# EAGLE board Hive 1.0 (EAGLE 9.6.2), part 1 of 2
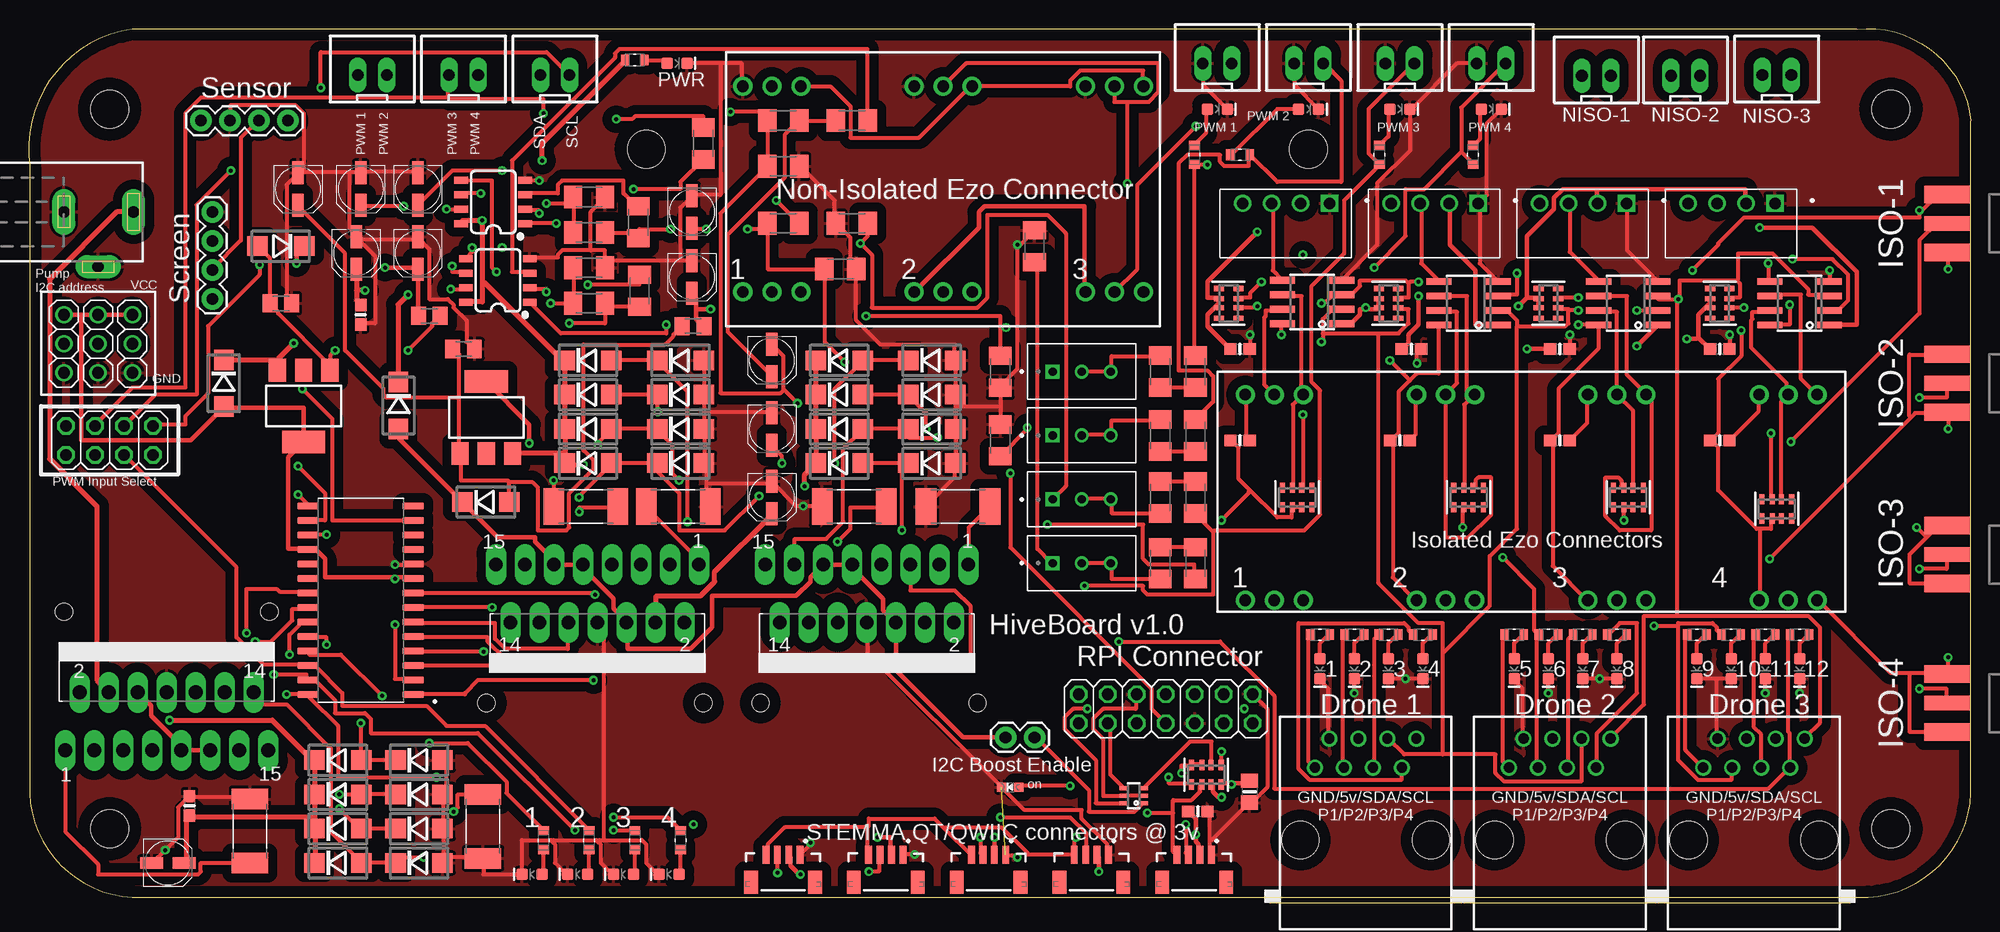
[diagram p2: board, top side]
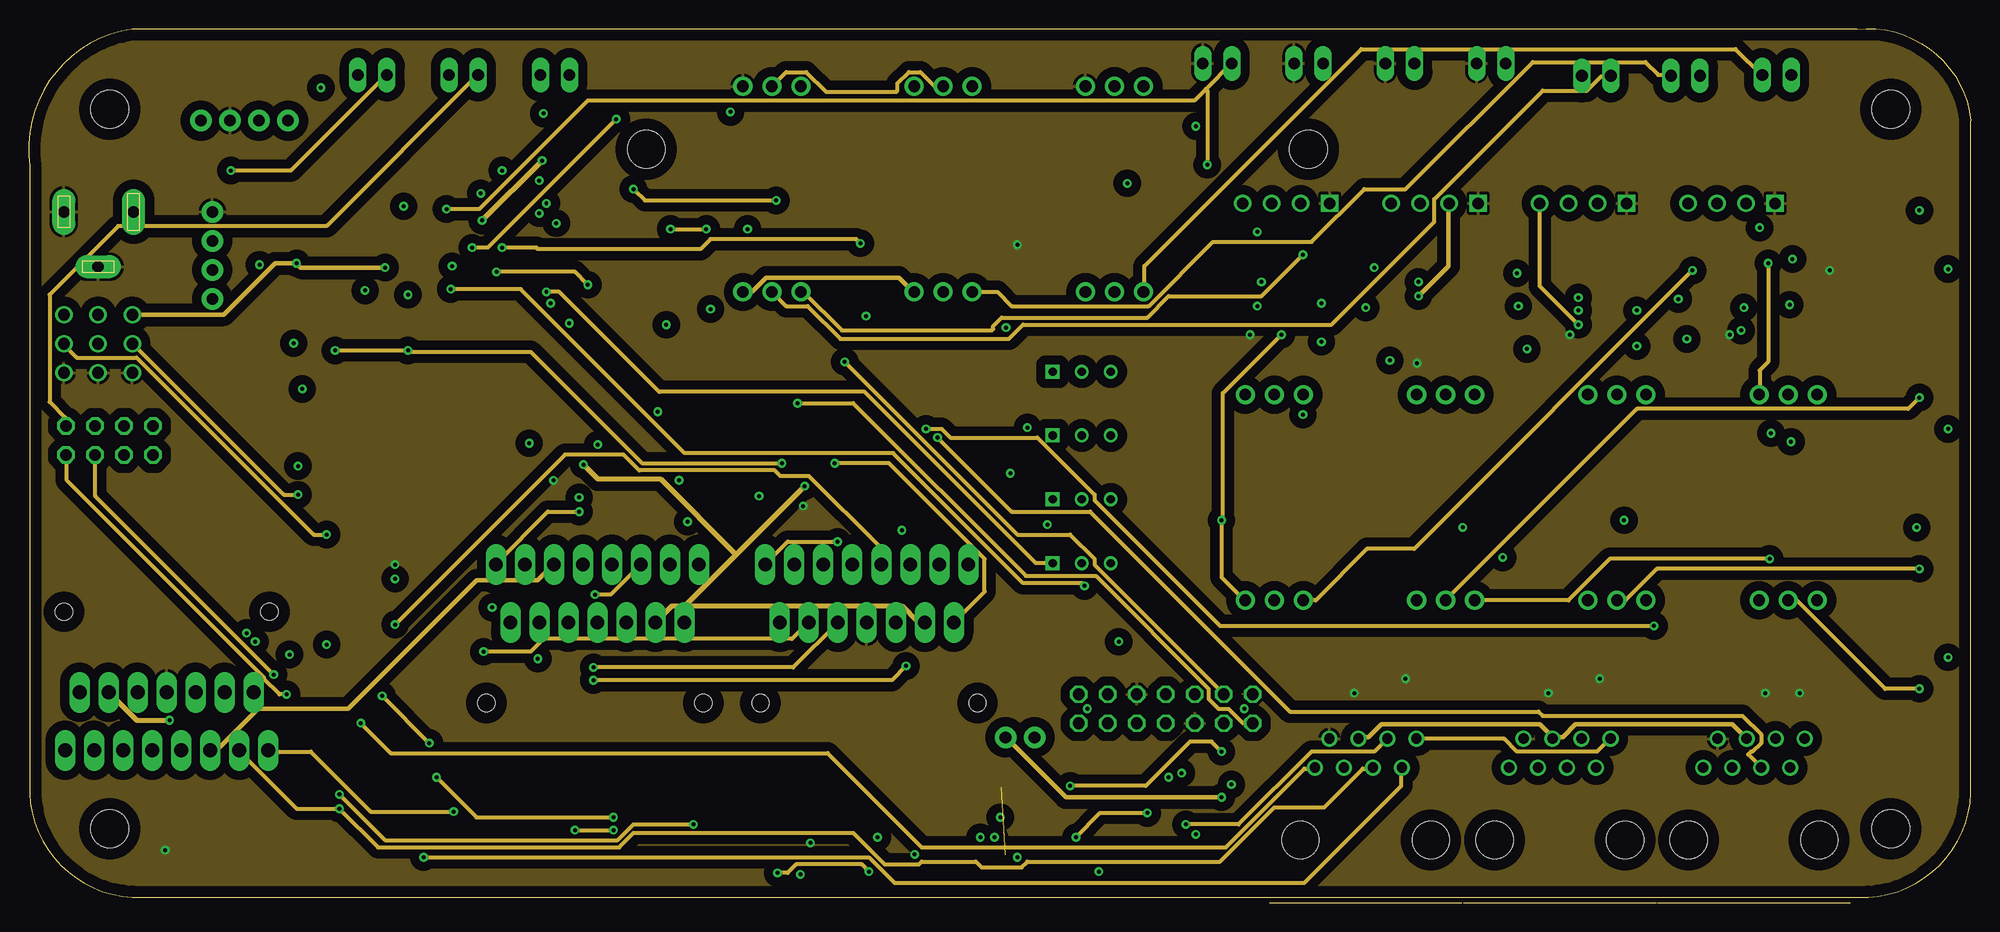
[diagram p3: board, inner layer Route2]
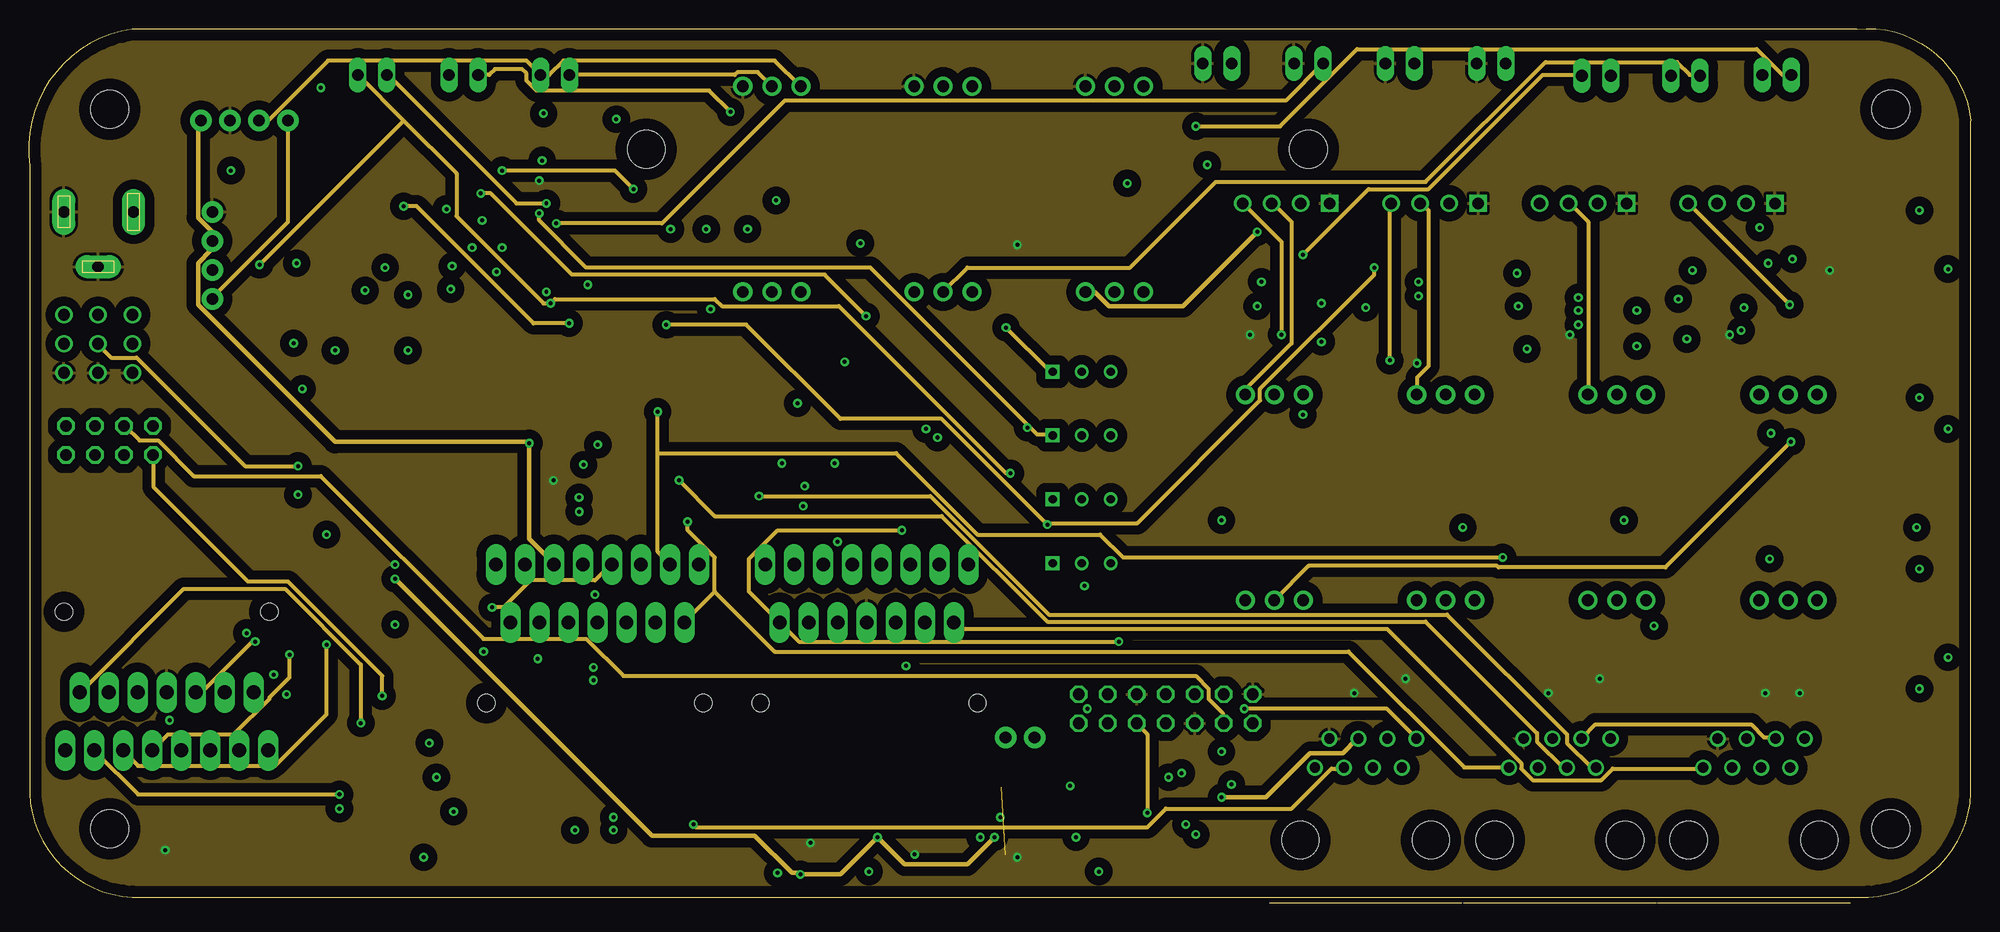
[diagram p4: board, inner layer Route15]
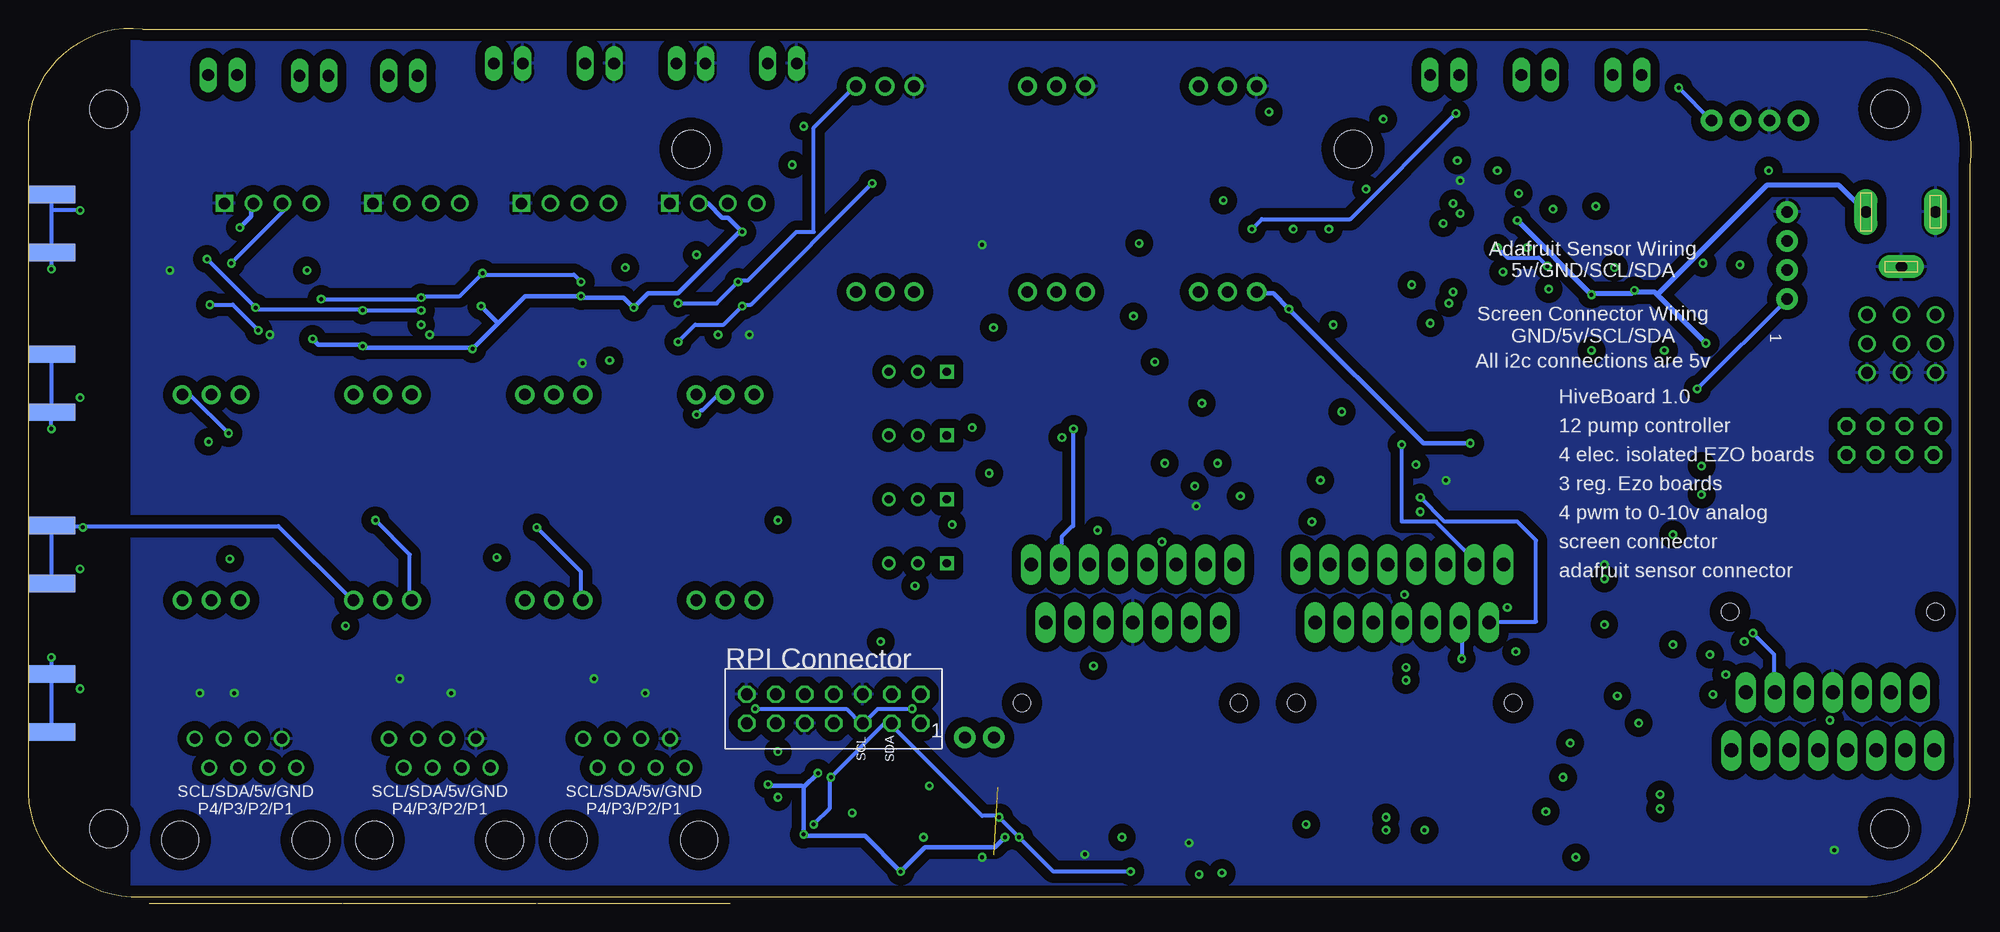
[diagram p5: board, bottom side, seen from below]

Size 170.1 x 76.05 mm. Coordinates in mm from the lower left corner, seen from the top.
Outline: 9.1,0 161.1,0 arc90 170.1,10 170.1,68 arc90 160.1,76 9.1,76 arc90 0.1,64 0.1,10 arc90 9.1,0
Copper layers (1+2*15+16): Top 0.035mm / dielectric 1.5mm / Route2 0.035mm / dielectric 0.15mm / Route15 0.035mm / dielectric 0.2mm / Bottom 0.035mm
Design rules "default *": minimum track width 6mil, minimum drill 0.35mm, track to track 6mil, track to pad 6mil, pad to pad 6mil, via to via 6mil, smd to smd 6mil, copper to edge 40mil, drill to drill 6mil, minimum pad ring 10mil, minimum via ring 8mil, stop-mask expansion 4mil, vias tented up to drill 0mil, thermal gap 10mil
Net classes: 0 default: width 0.356 mm, drill 0.102 mm, clearance 0.254 mm; 1 highpower: width 0.356 mm, drill 0.356 mm; 2 12v: width 0.457 mm, drill 0.102 mm, clearance 0.254 mm; 3 5v: width 0.406 mm, drill 0.102 mm, clearance 0.254 mm; 4 3.3v: width 0.406 mm, drill 0.102 mm, clearance 0.254 mm; 5 i2c: width 0.356 mm, drill 0.102 mm, clearance 0.254 mm; 6 GPIO: width 0.356 mm, drill 0.102 mm, clearance 0.254 mm; 8 New Class: drill 0.102 mm, clearance 0.152 mm
Holes 1.5 mm at 40.1,17 59.1,17 64.1,17 83.1,17 21.1,25 3.1,25

## Footprints (pad centres in the part's own frame; a part is rotated, then mirrored left to right if it is on the bottom)
RESC1608X60N = smd 0.762 x 0.94: 1 -0.838,0; 2 0.838,0
JST-XH-02-PACKAGE-LONG-PAD = drill 1.016 long: 1 -1.27,0; 2 1.27,0
UD-4X5,8_NICHICON = smd 2 x 1: + 1.425,0; - -1.425,0
0603-NO = smd 1.075 x 1: 1 -0.85,0; 2 0.85,0
0805-NO = smd 1.24 x 1.5: 1 -0.95,0; 2 0.95,0
DO214BA = smd 1.8 x 1.7: A 2.05,0; C -2.05,0
CHIPLED_0603_NOOUTLINE = smd 0.8 x 0.8: A 0,-0.75; C 0,0.75
STAND-OFF = hole 3.302: 0,0
MULTIWATT-15 = drill 1.2 long: 1 -8.89,-7.62; 2 -7.62,-2.54; 3 -6.35,-7.62; 4 -5.08,-2.54; 5 -3.81,-7.62; 6 -2.54,-2.54; 7 -1.27,-7.62; 8 0,-2.54; 9 1.27,-7.62; 10 2.54,-2.54; 11 3.81,-7.62; 12 5.08,-2.54; 13 6.35,-7.62; 14 7.62,-2.54; 15 8.89,-7.62
SOT223 = smd 1.5 x 2: 1 -2.3,-3.15; 2 0,-3.15; 3 2.3,-3.15 | smd 3.8 x 2: 4 0,3.15
SC70-6L = smd 0.35 x 0.8: 1 -0.65,-0.85; 2 0,-0.85; 3 0.65,-0.85; 4 0.65,0.85; 5 0,0.85; 6 -0.65,0.85
DCJ0202 = drill 1 pad 2 long: 1 0,3.1; 2 4.8,0; 3 0,-3
1X04 = drill 1.016 pad 1.88: 1 0,0; 2 2.54,0; 3 5.08,0; 4 7.62,0
JST04_1MM_VERT = smd 0.6 x 1.55: 1 -1.478,0.775; 2 -0.478,0.775; 3 0.522,0.775; 4 1.522,0.775 | smd 1.2 x 2: NC1 -2.778,3.2; NC2 2.822,3.2
1X03-CLEANBIG = drill 1.016 pad 1.676: 1 -2.54,0; 2 0,0; 3 2.54,0
2X07 = drill 1.016 octagon: 1 -7.62,-1.27; 2 -7.62,1.27; 3 -5.08,-1.27; 4 -5.08,1.27; 5 -2.54,-1.27; 6 -2.54,1.27; 7 0,-1.27; 8 0,1.27; 9 2.54,-1.27; 10 2.54,1.27; 11 5.08,-1.27; 12 5.08,1.27; 13 7.62,-1.27; 14 7.62,1.27
1X02 = drill 1.016 pad 1.88: 1 0,0; 2 2.54,0
2X04 = drill 1.016 octagon: 1 -3.81,-1.27; 2 -3.81,1.27; 3 -1.27,-1.27; 4 -1.27,1.27; 5 1.27,-1.27; 6 1.27,1.27; 7 3.81,-1.27; 8 3.81,1.27
LED-0603 = smd 1 x 1: A -0.877,0; C 0.877,0
CONV_RFM-0505S = drill 1 square: 1 -3.85,-1.75 | drill 1: 2 -1.31,-1.75; 3 1.23,-1.75; 4 3.77,-1.75
RJ45-NO-SHIELD = drill 0.9 pad 1.4: 1 -4.445,6.35; 2 -3.175,8.89; 3 -1.905,6.35; 4 -0.635,8.89; 5 0.635,6.35; 6 1.905,8.89; 7 3.175,6.35; 8 4.445,8.89 | hole 3.251: -5.715,0; 5.715,0
R2512 = smd 1.8 x 3.2: 1 -2.8,0; 2 2.8,0
M1206 = smd 1.6 x 2: 1 -1.4,0; 2 1.4,0
TRIM_3296W-1-103 = drill 0.71 square: 1 -2.54,0 | drill 0.71: 2 0,0; 3 2.54,0
RESPACK_4X0603 = smd 0.45 x 0.9: 1 -1.3,-0.85; 2 -0.4,-0.85; 3 0.4,-0.85; 4 1.3,-0.85; 5 1.3,0.85; 6 0.4,0.85; 7 -0.4,0.85; 8 -1.3,0.85
M0805 = smd 1.3 x 1.6: 1 -0.95,0; 2 0.95,0
1X03 = drill 1.016: 1 -2.54,0; 2 0,0; 3 2.54,0
SO08 = smd 0.6 x 1.2: 1 -1.905,-2.8; 2 -0.635,-2.8; 3 0.635,-2.8; 4 1.905,-2.8; 5 1.905,2.8; 6 0.635,2.8; 7 -0.635,2.8; 8 -1.905,2.8
SOIC127P1030X265-28N = smd 1.9 x 0.6: 1 -4.605,8.255; 2 -4.605,6.985; 3 -4.605,5.715; 4 -4.605,4.445; 5 -4.605,3.175; 6 -4.605,1.905; 7 -4.605,0.635; 8 -4.605,-0.635; 9 -4.605,-1.905; 10 -4.605,-3.175; 11 -4.605,-4.445; 12 -4.605,-5.715; 13 -4.605,-6.985; 14 -4.605,-8.255; 15 4.605,-8.255; 16 4.605,-6.985; 17 4.605,-5.715; 18 4.605,-4.445; 19 4.605,-3.175; 20 4.605,-1.905; 21 4.605,-0.635; 22 4.605,0.635; 23 4.605,1.905; 24 4.605,3.175; 25 4.605,4.445; 26 4.605,5.715; 27 4.605,6.985; 28 4.605,8.255
SMA_EDGELAUNCH = smd 4.064 x 1.524: GND@1 2.032,-2.54; GND@2 2.032,2.54 | smd 4.064 x 1.524 bottom: GND@3 2.032,2.54; GND@4 2.032,-2.54 | smd 4.064 x 1.27: P 2.032,0
SOIC8_150MIL = smd 0.6 x 2.2: 1 -1.905,-2.6; 2 -0.635,-2.6; 3 0.635,-2.6; 4 1.905,-2.6; 5 1.905,2.6; 6 0.635,2.6; 7 -0.635,2.6; 8 -1.905,2.6

## Placement (x,y rotation side)
12V  330R  [RESC1608X60N]  53.1,73.3 0 top
(0-10V)-1  jst-xh-2  [JST-XH-02-PACKAGE-LONG-PAD]  112.1,73 0 top
(0-10V)-2  jst-xh-2  [JST-XH-02-PACKAGE-LONG-PAD]  128.1,73 0 top
C1  100nF  [UD-4X5,8_NICHICON]  12.2,3 0 top
C1A1  1uf 50v  [UD-4X5,8_NICHICON]  29.1,62 270 top
C1A2  1uf 50v  [UD-4X5,8_NICHICON]  34.1,62 270 top
C1B1  1uf 50v  [UD-4X5,8_NICHICON]  58.1,60 270 top
C1B2  1uf 50v  [UD-4X5,8_NICHICON]  65.1,47 270 top
C2  100nF  [UD-4X5,8_NICHICON]  28.7,56.4 270 top
C3  100nF  [UD-4X5,8_NICHICON]  65.1,35 270 top
C4  0.1uF  [0603-NO]  120.1,40 0 top
C5  0.1uF  [0603-NO]  121.1,48 0 top
C6  0.1uF  [0603-NO]  106.1,40 0 top
C7  0.1uF  [0603-NO]  106.1,48 0 top
C8  0.1uF  [0603-NO]  134.1,40 0 top
C9  0.1uF  [0603-NO]  134.1,48 0 top
C10  0.1uF  [0603-NO]  148.1,40 0 top
C11  0.1uF  [0603-NO]  148.1,48 0 top
C13  1uF  [UD-4X5,8_NICHICON]  34.1,56.4 270 top
C14  10uF 35v  [UD-4X5,8_NICHICON]  65.1,41 270 top
C15  0.1uF  [0603-NO]  29.1,51 90 top
C16  1uF 50v  [UD-4X5,8_NICHICON]  58.1,54.3 270 top
C17  10uF 35v  [UD-4X5,8_NICHICON]  23.6,62 270 top
C18  0.1uF  [0603-NO]  14.1,8 270 top
C20  10uF  [0805-NO]  106.92,9.24 270 top
C21  0.1uF  [0603-NO]  102.4,7.52 0 top
D1  1N4004  [DO214BA]  27.1,12 0 top
D2  1N4004  [DO214BA]  27.1,9 0 top
D3  1N4004  [DO214BA]  27.1,6 0 top
D4  1N4004  [DO214BA]  27.1,3 0 top
D5  1N4004  [DO214BA]  34.2,12 0 top
D6  1N4004  [DO214BA]  34.2,9 0 top
D7  1N4004  [DO214BA]  34.2,6 0 top
D8  1N4004  [DO214BA]  34.2,3 0 top
D9  1N4004  [DO214BA]  49,47 0 top
D10  1N4004  [DO214BA]  49,44 0 top
D11  1N4004  [DO214BA]  49,41 0 top
D12  1N4004  [DO214BA]  49,38 0 top
D13  1N4004  [DO214BA]  57.1,47 0 top
D14  1N4004  [DO214BA]  57.1,44 0 top
D15  1N4004  [DO214BA]  57.1,41 0 top
D16  1N4004  [DO214BA]  57.1,38 0 top
D17  1N4004  [DO214BA]  71,47 0 top
D18  1N4004  [DO214BA]  71,44 0 top
D19  1N4004  [DO214BA]  71,41 0 top
D20  1N4004  [DO214BA]  71,38 0 top
D21  1N4004  [DO214BA]  79.1,47 0 top
D22  1N4004  [DO214BA]  79.1,44 0 top
D23  1N4004  [DO214BA]  79.1,41 0 top
D24  1N4004  [DO214BA]  79.1,38 0 top
D26  GREEN  [CHIPLED_0603_NOOUTLINE]  85.97,9.64 90 top
D33  1N4002  [DO214BA]  32.4,43.05 270 top
D34  1N4002  [DO214BA]  40.05,34.6 0 top
D35  1N4004  [DO214BA]  22.1,57 180 top
D36  1N4004  [DO214BA]  17.1,45 270 top
H5  STAND-OFF  [STAND-OFF]  7.1,69 0 top
H6  STAND-OFF  [STAND-OFF]  7.1,6 0 top
H7  STAND-OFF  [STAND-OFF]  163.1,6 0 top
H8  STAND-OFF  [STAND-OFF]  163.1,69 0 top
IC1  L298  [MULTIWATT-15]  12.1,20.48 0 top
IC2  L298  [MULTIWATT-15]  49.82,21.52 180 top
IC3  L298  [MULTIWATT-15]  73.41,21.52 180 top
IC4  LM317MBSTT3  [SOT223]  24.1,43 180 top
IC5  LM317MBSTT3  [SOT223]  40.1,42 0 top
IC7  LTC4311_SC70  [SC70-6L]  96.8,8.89 90 top
J1  DCJ0202  [DCJ0202]  6.1,60 270 top
J2  [1X04]  15.1,68 0 top
J3  [1X04]  16.1,60 270 top
J4  Vertical Qwiic Connector  [JST04_1MM_VERT]  66.1,4.5 180 top
J5  Vertical Qwiic Connector  [JST04_1MM_VERT]  75.1,4.5 180 top
J7  Vertical Qwiic Connector  [JST04_1MM_VERT]  84.1,4.5 180 top
J8  Vertical Qwiic Connector  [JST04_1MM_VERT]  93.1,4.5 180 top
J9  Vertical Qwiic Connector  [JST04_1MM_VERT]  102.1,4.5 180 top
JP1  [1X03-CLEANBIG]  80.1,53 0 top
JP2  [1X03-CLEANBIG]  65.1,53 0 top
JP3  [1X03-CLEANBIG]  80.1,71 180 top
JP4  [1X03-CLEANBIG]  65.1,71 180 top
JP5  [1X03-CLEANBIG]  95.1,53 0 top
JP6  [1X03-CLEANBIG]  95.1,71 180 top
JP7  [1X03-CLEANBIG]  109.1,44 180 top
JP8  [1X03-CLEANBIG]  109.1,26 0 top
JP9  [1X03-CLEANBIG]  124.1,44 180 top
JP10  [1X03-CLEANBIG]  124.1,26 0 top
JP11  [1X03-CLEANBIG]  139.1,44 180 top
JP12  [1X03-CLEANBIG]  139.1,26 0 top
JP13  [1X03-CLEANBIG]  154.1,44 180 top
JP14  [1X03-CLEANBIG]  154.1,26 0 top
JP15  [2X07]  99.6,16.5 0 top
JP16  [1X02]  88.1,14 180 top
JP19  [2X04]  7.1,40 180 top
LED4  Red  [LED-0603]  56.8,73 0 top
LED7  BLUE  [LED-0603]  113.1,20 270 top
LED8  GREEN  [LED-0603]  116.1,20 270 top
LED9  Yellow  [LED-0603]  119.1,20 270 top
LED10  RED  [LED-0603]  122.1,20 270 top
LED11  BLUE  [LED-0603]  130.1,20 270 top
LED12  GREEN  [LED-0603]  133.1,20 270 top
LED13  Yellow  [LED-0603]  136.1,20 270 top
LED14  RED  [LED-0603]  139.1,20 270 top
LED15  BLUE  [LED-0603]  146.1,20 270 top
LED16  GREEN  [LED-0603]  149.1,20 270 top
LED17  Yellow  [LED-0603]  152.1,20 270 top
LED18  RED  [LED-0603]  155.1,20 270 top
LED19  Blue  [LED-0603]  104.1,69 0 top
LED20  BLUE  [LED-0603]  44.1,2 180 top
LED21  GREEN  [LED-0603]  112.1,69 0 top
LED22  BLUE  [LED-0603]  120.1,69 0 top
LED23  GREEN  [LED-0603]  48.1,2 180 top
LED24  GREEN  [LED-0603]  128.1,69 0 top
LED25  Yellow  [LED-0603]  52.1,2 180 top
LED27  RED  [LED-0603]  56.1,2 180 top
PS1  RFM-0505S  [CONV_RFM-0505S]  110.1,59 180 top
PS2  RFM-0505S  [CONV_RFM-0505S]  123.1,59 180 top
PS3  RFM-0505S  [CONV_RFM-0505S]  136.1,59 180 top
PS4  RFM-0505S  [CONV_RFM-0505S]  149.1,59 180 top
PUMPBOX-1  RJ45-6L-B  [RJ45-NO-SHIELD]  117.1,5 0 top
PUMPBOX-2  RJ45-6L-B  [RJ45-NO-SHIELD]  134.1,5 0 top
PUMPBOX-3  RJ45-6L-B  [RJ45-NO-SHIELD]  151.1,5 0 top
R1  0,5 x 2W  [R2512]  39.8,6.2 90 top
R1A1  100kΩ  [M1206]  49.1,52 180 top
R1A2  100kΩ  [M1206]  66.1,59 180 top
R1B1  100kΩ  [M1206]  49.1,58.2 0 top
R1B2  100kΩ  [M1206]  66.1,68 0 top
R2  0,5 x 2W  [R2512]  19.4,5.8 270 top
R2A1  100kΩ  [M1206]  85.1,46 90 top
R2A2  100kΩ  [M1206]  72.1,59 0 top
R2B1  100kΩ  [M1206]  85.1,40 90 top
R2B2  100kΩ  [M1206]  88.1,57 90 top
R3  0,5 x 2W  [R2512]  48.8,34.2 0 top
R3-1A1  3296W-1-103  [TRIM_3296W-1-103]  92.23,46.02 0 top
R3-1A2  3296W-1-103  [TRIM_3296W-1-103]  92.23,34.84 0 top
R3-1B1  3296W-1-103  [TRIM_3296W-1-103]  92.23,40.43 0 top
R3-1B2  3296W-1-103  [TRIM_3296W-1-103]  92.23,29.25 0 top
R3-2A1  180KΩ  [M1206]  99.1,46.02 270 top
R3-2A2  180KΩ  [M1206]  99.1,35 90 top
R3-2B1  180KΩ  [M1206]  99.1,40.43 270 top
R3-2B2  180KΩ  [M1206]  99.1,29.25 90 top
R3-3A1  15kΩ  [M1206]  102.2,46.02 90 top
R3-3A2  15kΩ  [M1206]  102.2,35 270 top
R3-3B1  15kΩ  [M1206]  102.2,40.43 90 top
R3-3B2  15kΩ  [M1206]  102.2,29.25 270 top
R4  0,5 x 2W  [R2512]  56.9,34.2 180 top
R4A1  75kΩ  [M1206]  53.5,53.1 90 top
R4A2  75kΩ  [M1206]  59.1,66 90 top
R4B1  75kΩ  [M1206]  53.4,59.1 90 top
R4B2  75kΩ  [M1206]  72.1,68 0 top
R5  0,5 x 2W  [R2512]  72.3,34.2 0 top
R5A1  10kΩ  [M1206]  49.1,55.1 0 top
R5A2  10kΩ  [M1206]  71.1,55 0 top
R5B1  10kΩ  [M1206]  49.1,61.3 0 top
R5B2  10kΩ  [M1206]  66.1,64 0 top
R6  0,5 x 2W  [R2512]  81.4,34.2 0 top
R7  10K  [RESPACK_4X0603]  119.1,52 90 top
R8  10K  [RESPACK_4X0603]  126.1,35 180 top
R9  10K  [RESPACK_4X0603]  105.1,52 90 top
R10  10K  [RESPACK_4X0603]  111.1,35 180 top
R11  10K  [RESPACK_4X0603]  133.1,52 90 top
R12  10K  [RESPACK_4X0603]  140.1,35 180 top
R13  10K  [RESPACK_4X0603]  148.1,52 90 top
R14  10K  [RESPACK_4X0603]  153.1,34 180 top
R15  240Ω  [M0805]  35.1,50.9 180 top
R16  394Ω  [M0805]  22.1,52 180 top
R17  240Ω  [M0805]  58.2,50 0 top
R18  720Ω  [M0805]  38.1,48 180 top
R20  330R  [RESC1608X60N]  113.1,23 0 top
R21  330R  [RESC1608X60N]  116.1,23 0 top
R22  330R  [RESC1608X60N]  119.1,23 0 top
R23  330R  [RESC1608X60N]  122.1,23 0 top
R24  330R  [RESC1608X60N]  130.1,23 0 top
R25  330R  [RESC1608X60N]  133.1,23 0 top
R26  330R  [RESC1608X60N]  136.1,23 0 top
R27  330R  [RESC1608X60N]  139.1,23 0 top
R28  330R  [RESC1608X60N]  146.1,23 0 top
R29  330R  [RESC1608X60N]  149.1,23 0 top
R30  330R  [RESC1608X60N]  152.1,23 0 top
R31  330R  [RESC1608X60N]  155.1,23 0 top
R32  330R  [RESC1608X60N]  102.1,65 90 top
R33  330R  [RESC1608X60N]  45.1,5 270 top
R34  330R  [RESC1608X60N]  106.1,65 180 top
R35  330R  [RESC1608X60N]  118.3,65 90 top
R36  330R  [RESC1608X60N]  49.1,5 270 top
R37  330R  [RESC1608X60N]  126.5,65 90 top
R38  330R  [RESC1608X60N]  53.1,5 270 top
R39  10K  [RESPACK_4X0603]  103.15,10.73 0 top
R40  330R  [RESC1608X60N]  57.1,5 270 top
SJ1  [1X03]  3.1,48.46 90 top
SJ2  [1X03]  6.1,48.46 90 top
SJ3  [1X03]  9.1,48.46 90 top
U1  LM358  [SO08]  41.1,54 90 top
U2  LM358  [SO08]  40.69,60.87 90 top
U3  MCP23017-E/SO  [SOIC127P1030X265-28N]  29.1,26 180 top
U$1  [STAND-OFF]  54.1,65.5 0 top
U$2  [STAND-OFF]  112.1,65.5 0 top
X1  [SMA_EDGELAUNCH]  170.1,59 180 top
X2  [SMA_EDGELAUNCH]  170.1,45 180 top
X3  jst-xh-2  [JST-XH-02-PACKAGE-LONG-PAD]  120.1,73 0 top
X4  jst-xh-2  [JST-XH-02-PACKAGE-LONG-PAD]  104.1,73 0 top
X5  PWM-IN  [JST-XH-02-PACKAGE-LONG-PAD]  30.1,72 0 top
X6  [SMA_EDGELAUNCH]  170.1,30 180 top
X7  [SMA_EDGELAUNCH]  170.1,17 180 top
X8  PWM-IN  [JST-XH-02-PACKAGE-LONG-PAD]  38.1,72 0 top
X11  jst-xh-2  [JST-XH-02-PACKAGE-LONG-PAD]  145.1,71.92 0 top
X12  jst-xh-2  [JST-XH-02-PACKAGE-LONG-PAD]  137.3,71.92 0 top
X13  ISO154X  [SOIC8_150MIL]  112.4,52.11 90 top
X14  ISO154X  [SOIC8_150MIL]  126.1,52 90 top
X16  ISO154X  [SOIC8_150MIL]  140.1,52 90 top
X18  ISO154X  [SOIC8_150MIL]  155.1,52 90 top
X20  jst-xh-2  [JST-XH-02-PACKAGE-LONG-PAD]  153.1,72 0 top
X21  jst-xh-2  [JST-XH-02-PACKAGE-LONG-PAD]  46.1,72 0 top